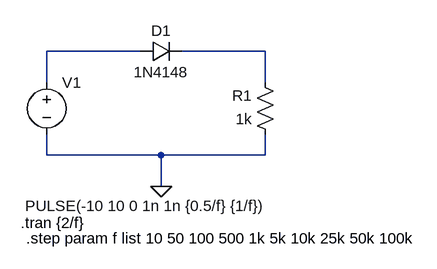
[diagram p0: schematic Diodo4148Frecuencias_2.asc]
Diodo4148Frecuencias_2.asc, the LTspice schematic file:
Version 4.1
SHEET 1 880 680
WIRE 208 64 64 64
WIRE 400 64 272 64
WIRE 64 112 64 64
WIRE 400 112 400 64
WIRE 64 224 64 192
WIRE 240 224 64 224
WIRE 400 224 400 192
WIRE 400 224 240 224
WIRE 240 272 240 224
FLAG 240 272 0
SYMBOL voltage 64 96 R0
WINDOW 3 -33 206 Left 2
WINDOW 123 0 0 Left 0
WINDOW 39 0 0 Left 0
SYMATTR InstName V1
SYMATTR Value PULSE(-10 10 0 1n 1n {0.5/f} {1/f})
SYMBOL res 416 208 R180
WINDOW 0 36 76 Left 2
WINDOW 3 36 40 Left 2
SYMATTR InstName R1
SYMATTR Value 1k
SYMBOL diode 208 80 R270
WINDOW 0 32 32 VTop 2
WINDOW 3 0 32 VBottom 2
SYMATTR InstName D1
SYMATTR Value 1N4148
TEXT 24 328 Left 2 !.tran {2/f}
TEXT 32 352 Left 2 !.step param f list 10 50 100 500 1k 5k 10k 25k 50k 100k

The netlist it stands for:
* Diodo4148Frecuencias_2.asc
V1 N001 0 PULSE(-10 10 0 1n 1n {0.5/f} {1/f})
R1 0 N002 1k
D1 N001 N002 1N4148
.model D D
.lib standard.dio
.tran {2/f}
.step param f list 10 50 100 500 1k 5k 10k 25k 50k 100k
.backanno
.end